# EAGLE schematic led (EAGLE 9.2.1)
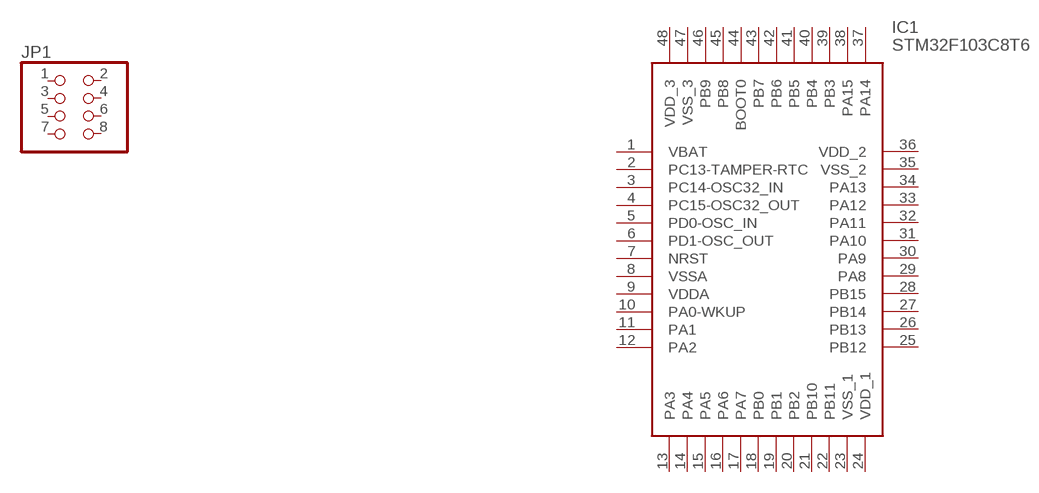
[diagram p0: schematic, sheet 1]

## Parts
IC1  STM32F103C8T6  [QFP50P900X900X160-48N]
JP1  PINHD-2X4  [2X04]
Unconnected: IC1.1(VBAT) IC1.2(PC13-TAMPER-RTC) IC1.3(PC14-OSC32_IN) IC1.4(PC15-OSC32_OUT) IC1.5(PD0-OSC_IN) IC1.6(PD1-OSC_OUT) IC1.7(NRST) IC1.10(PA0-WKUP) IC1.11(PA1) IC1.12(PA2) IC1.13(PA3) IC1.14(PA4) IC1.15(PA5) IC1.16(PA6) IC1.17(PA7) IC1.18(PB0) IC1.19(PB1) IC1.20(PB2) IC1.21(PB10) IC1.22(PB11) IC1.25(PB12) IC1.26(PB13) IC1.27(PB14) IC1.28(PB15) IC1.29(PA8) IC1.30(PA9) IC1.31(PA10) IC1.32(PA11) IC1.33(PA12) IC1.34(PA13) IC1.37(PA14) IC1.38(PA15) IC1.39(PB3) IC1.40(PB4) IC1.41(PB5) IC1.42(PB6) IC1.43(PB7) IC1.44(BOOT0) IC1.45(PB8) IC1.46(PB9) JP1.1 JP1.2 JP1.3 JP1.4 JP1.5 JP1.6 JP1.7 JP1.8

## Power pins joined to a net without a drawn wire
VDD_1: IC1.24(VDD_1)
VDD_2: IC1.36(VDD_2)
VDD_3: IC1.48(VDD_3)
VDDA: IC1.9(VDDA)
VSS_1: IC1.23(VSS_1)
VSS_2: IC1.35(VSS_2)
VSS_3: IC1.47(VSS_3)
VSSA: IC1.8(VSSA)

## Library data of the parts
IC1 = STM32F103C8T6:STM32F103C8T6: STM32F103C8T6, 32 bit ARM Cortex M3 Microcontroller 72MHz 64kb Flash, 20kb RAM, USB I2C SPI 48-Pin LQFP Source: Datasheet <http://www.st.com/st-web-ui/static/active/en/resource/technical/document/datasheet/CD00161566.pdf>; ALLIED_NUMBER: 70390993; ALLIED_PRICE-STOCK: http://www.alliedelec.com/stmicroelectronics-stm32f103c8t6/70390993/; ARROW_PART_NUMBER: STM32F103C8T6; ARROW_PRICE-STOCK: https://www.arrow.com/en/products/stm32f103c8t6/stmicroelectronics; DESCRIPTION: STM32F103C8T6, 32 bit ARM Cortex M3 Microcontroller 72MHz 64kb Flash, 20kb RAM, USB I2C SPI 48-Pin LQFP; HEIGHT: 1.6mm; MANUFACTURER_NAME: STMicroelectronics; MANUFACTURER_PART_NUMBER: STM32F103C8T6; RS_PART_NUMBER: 0402279P; RS_PRICE-STOCK: http://uk.rs-online.com/web/p/products/0402279P
JP1 = adafruit:PINHD-2X4: PIN HEADER